# Altium schematic sheet mcu.SchDoc: MCU
size A4; Organization: GPA & FRYK Industries; DocumentNumber: 2; Revision: REV 0; SheetNumber: 2; SheetTotal: 6
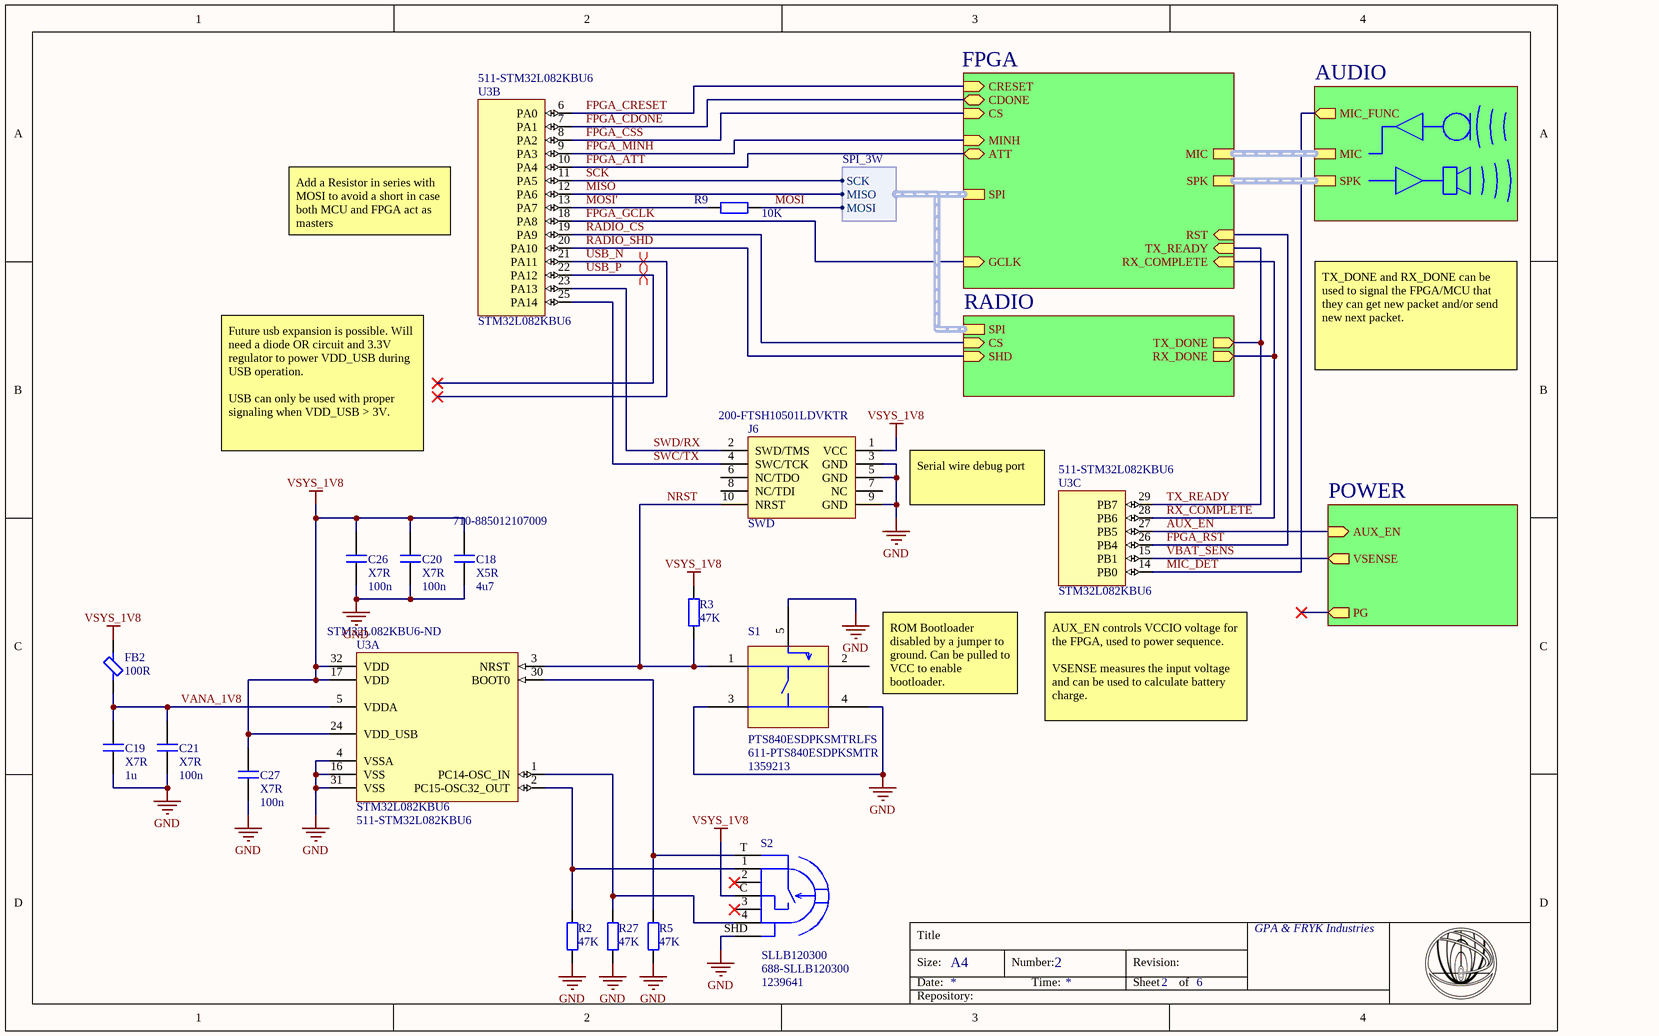
[diagram p0: mcu.SchDoc]

## Parts
C18  value 4u7  type: X5R  Supplier Part Number 1: 710-885012107009  [CAPC2012X11N]  (hidden comment: cap)
C19  value 1u  type: X7R  [CAPC2012X11N]  (hidden comment: cap)
C20  value 100n  type: X7R  [CAPC1005X06N]  (hidden comment: cap)
C21  value 100n  type: X7R  [CAPC1005X06N]  (hidden comment: cap)
C26  value 100n  type: X7R  [CAPC1005X06N]  (hidden comment: cap)
C27  value 100n  type: X7R  [CAPC1005X06N]  (hidden comment: cap)
FB2  value 100R  [INDC1005X06N]  (hidden comment: ferrite)
J6  SWD  Supplier Part Number 1: 200-FTSH10501LDVKTR  [hdr_2x5_50mil]
R2  value 47K  [RESC1005X04N]  (hidden comment: res)
R3  value 47K  [RESC1005X04N]  (hidden comment: res)
R5  value 47K  [RESC1005X04N]  (hidden comment: res)
R9  value 10K  [RESC1005X04N]  (hidden comment: res)
R27  value 47K  [RESC1005X04N]  (hidden comment: res)
S1  PTS840ESDPKSMTRLFS  Supplier Part Number 1: 611-PTS840ESDPKSMTR  Supplier Part Number 2: 1359213  [PCBComponent_1]
S2  SLLB120300  Supplier Part Number 1: 688-SLLB120300  Supplier Part Number 2: 1239641  [sllb120300]
U3  STM32L082KBU6  Supplier Part Number 1: 511-STM32L082KBU6  Supplier Part Number 2: STM32L082KBU6-ND  [QFN50P500X500X60_HS-33N]  (parts A,B,C of 3)

## Sub-sheets
AUDIO = audio.SchDoc: MIC (harness PDM), SPK (harness PWM_D), MIC_FUNC (out)
FPGA = fpga.SchDoc: SPI (harness SPI_3W), MIC (harness PDM), SPK (harness PWM_D), CS (in), CDONE (bidir), GCLK (in), CRESET (in), ATT (bidir), MINH (in), TX_READY (in), RX_COMPLETE (in), RST (in)
POWER = power.SchDoc: AUX_EN (in), VSENSE (out), PG (out)
RADIO = radio.SchDoc: SPI (harness SPI_3W), CS (in), TX_DONE (out), RX_DONE (out), SHD (in)

## Harnesses
SPI_3W: MOSI, MISO, SCK

## Nets
GND: C18.1 C19.1 C20.2 C21.2 C26.2 C27.2 J6.3(GND) J6.5(GND) J6.9(GND) R2.1 R5.1 R27.1 S1.3 S1.4 S1.5 S2.SHD U3.4(VSSA) U3.16(VSS) U3.31(VSS)
VSYS_1V8: C18.2 C20.1 C26.1 C27.1 FB2.2 J6.1(VCC) R3.2 S2.C U3.17(VDD) U3.24(VDD_USB) U3.32(VDD)
AUX_EN: U3.27(PB5) ; sheet POWER/AUX_EN
FPGA_ATT: U3.10(PA4) ; sheet FPGA/ATT
FPGA_CDONE: U3.7(PA1) ; sheet FPGA/CDONE
FPGA_CRESET: U3.6(PA0) ; sheet FPGA/CRESET
FPGA_CSS: U3.8(PA2) ; sheet FPGA/CS
FPGA_GCLK: U3.18(PA8) ; sheet FPGA/GCLK
FPGA_MINH: U3.9(PA3) ; sheet FPGA/MINH
FPGA_RST: U3.26(PB4) ; sheet FPGA/RST
MIC_DET: U3.14(PB0) ; sheet AUDIO/MIC_FUNC
MISO: U3.12(PA6) ; sheet FPGA/SPI.MISO
MOSI: R9.2 ; sheet FPGA/SPI.MOSI
MOSI': R9.1 U3.13(PA7)
NRST: J6.10(NRST) R3.1 S1.1 U3.3(NRST)
RADIO_CS: U3.19(PA9) ; sheet RADIO/CS
RADIO_SHD: U3.20(PA10) ; sheet RADIO/SHD
RX_COMPLETE: U3.28(PB6) ; sheet FPGA/RX_COMPLETE, sheet RADIO/RX_DONE
SCK: U3.11(PA5) ; sheet FPGA/SPI.SCK
SWC/TX: J6.4(SWC/TCK) U3.25(PA14)
SWD/RX: J6.2(SWD/TMS) U3.23(PA13)
TX_READY: U3.29(PB7) ; sheet FPGA/TX_READY, sheet RADIO/TX_DONE
USB_N: U3.21(PA11)
USB_P: U3.22(PA12)
VANA_1V8: C19.2 C21.1 FB2.1 U3.5(VDDA)
VBAT_SENS: U3.15(PB1) ; sheet POWER/VSENSE
NetR2_2: R2.2 S2.1 U3.2(PC15-OSC32_OUT)
NetR5_2: R5.2 S2.T U3.30(BOOT0)
NetR27_2: R27.2 S2.4 U3.1(PC14-OSC_IN)

Not connected (* = marked no-connect by the designer): J6 6(NC/TDO) 7(NC) 8(NC/TDI); S1 2; S2 2* 3*

## Buses and harness runs
harness sheet AUDIO/MIC = sheet FPGA/MIC
harness sheet AUDIO/SPK = sheet FPGA/SPK
harness sheet FPGA/SPI = sheet RADIO/SPI

## Layout directives
differential pair: USB_N, USB_P

## Notes on the sheet
- Add a Resistor in series with MOSI to avoid a short in case both MCU and FPGA act as masters
- TX_DONE and RX_DONE can be used to signal the FPGA/MCU that they can get new packet and/or send new next packet.
- Future usb expansion is possible. Will need a diode OR circuit and 3.3V regulator to power VDD_USB during USB operation.
  USB can only be used with proper signaling when VDD_USB > 3V.
- Serial wire debug port
- ROM Bootloader disabled by a jumper to ground. Can be pulled to VCC to enable bootloader.
- (near U3) AUX_EN controls VCCIO voltage for the FPGA, used to power sequence.
  VSENSE measures the input voltage and can be used to calculate battery charge.
- Title
- Size:
- Date:
- A4
- Number:
- Time:
- Revision:
- Sheet
- of
- Repository:

## Library data of the parts
C18-C21 C26 C27 = cap: Capacitor; voltage: *; #digikey: *; #mouser: *; Supplier 1: Mouser
  C19: Supplier Part Number 1: 77-VJ0805Y105MXQTBC
  C20 C21 C26 C27: Supplier Part Number 1: 81-GCM155R71H103KA5J
FB2 = ferrite: Inductor; #digikey: *; #mouser: *; Supplier 1: Mouser; Supplier Part Number 1: 810-MMZ1005S102HT000
J6 = hdr_swd: SWD Header; Supplier 1: Mouser
R2 R3 R5 R9 R27 = res: Resistor; power: *; voltage: *; #digikey: *; #mouser: *
S1 = pts840esdpksmtrlfs: Microminiature SMT Side Actuated tactile switch; ComponentLink1Description: datasheet; ComponentLink1URL: https://www.mouser.se/datasheet/2/60/pts840-1280343.pdf; Supplier 1: Mouser; Supplier 2: RSComponents
S2 = sllb120300: Compact and low-profile horizontal type for various applications; ComponentLink1Description: datasheet; ComponentLink1URL: https://www.mouser.se/datasheet/2/15/SLLB-1370969.pdf; Supplier 1: Mouser; Supplier 2: RSComponents
U3 = stm32l082kbu6: Ultra-low-power 32-bit MCU Arm-based Cortex-M0+, up to 192KB / Flash, 20KB SRAM, 6KB EEPROM, USB, ADC, DACs, AES; ComponentLink1Description: datasheet; ComponentLink1URL: https://www.mouser.se/datasheet/2/389/stm32l082kb-956309.pdf; Supplier 1: Mouser; Supplier 2: Digi-Key